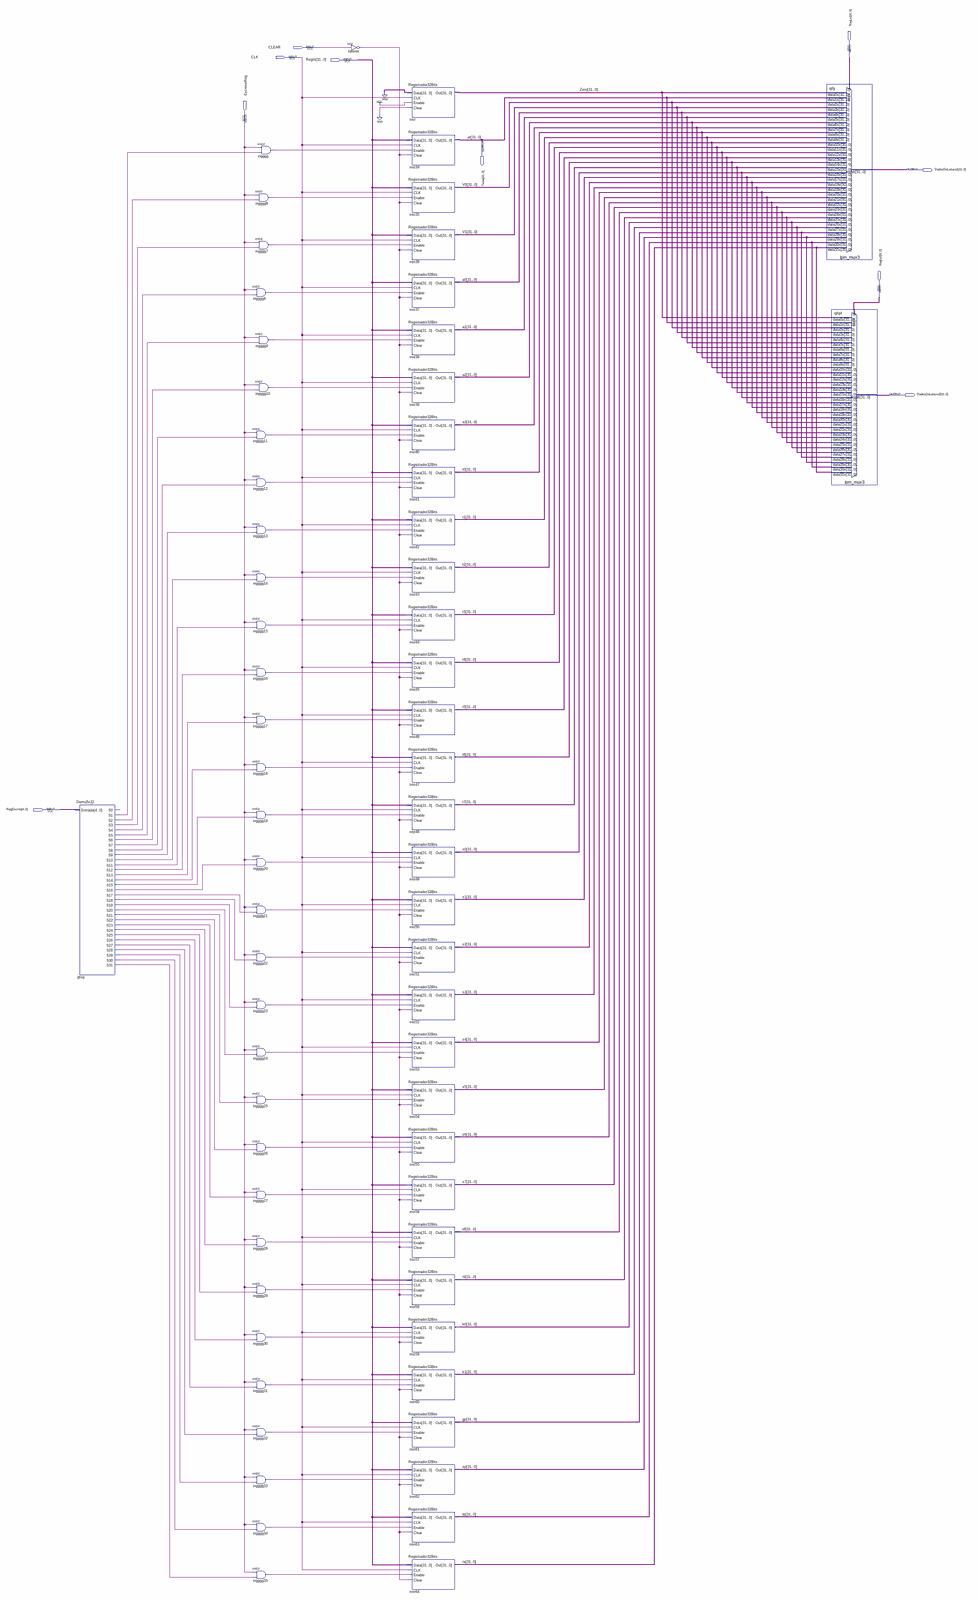
[diagram p0: schematic sheet, whole]
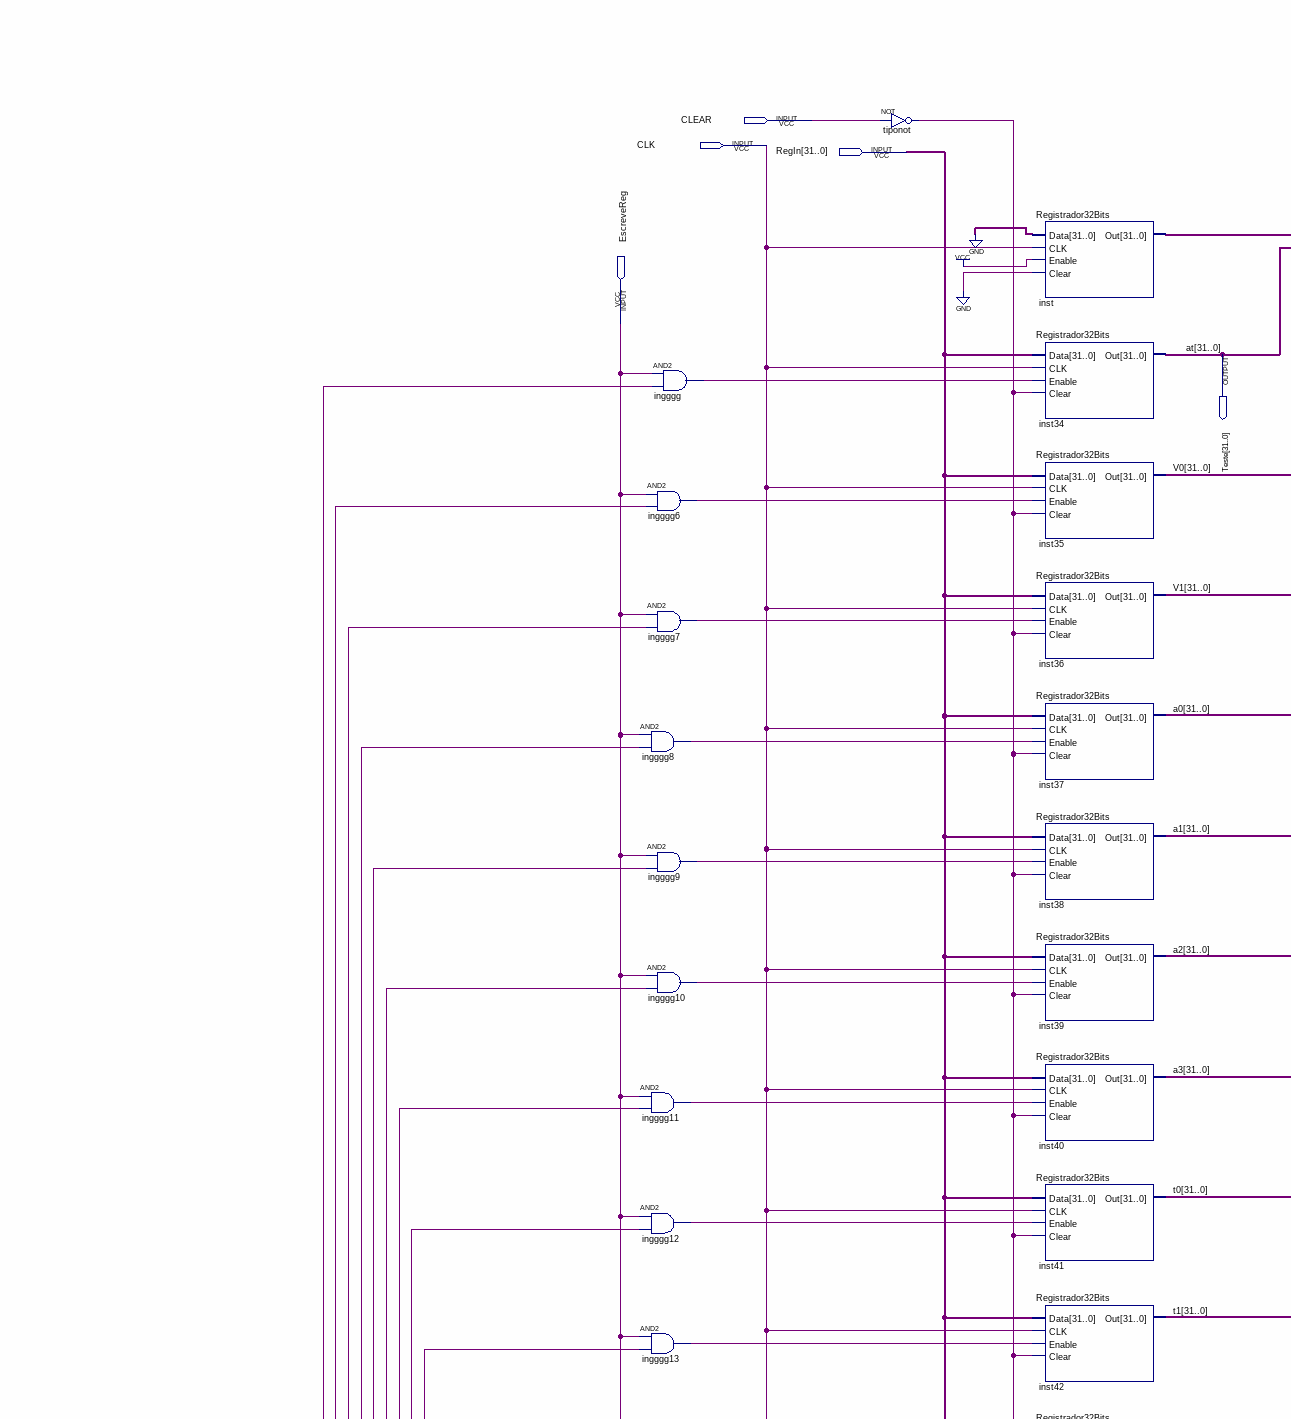
[diagram p1: schematic sheet, upper left part]
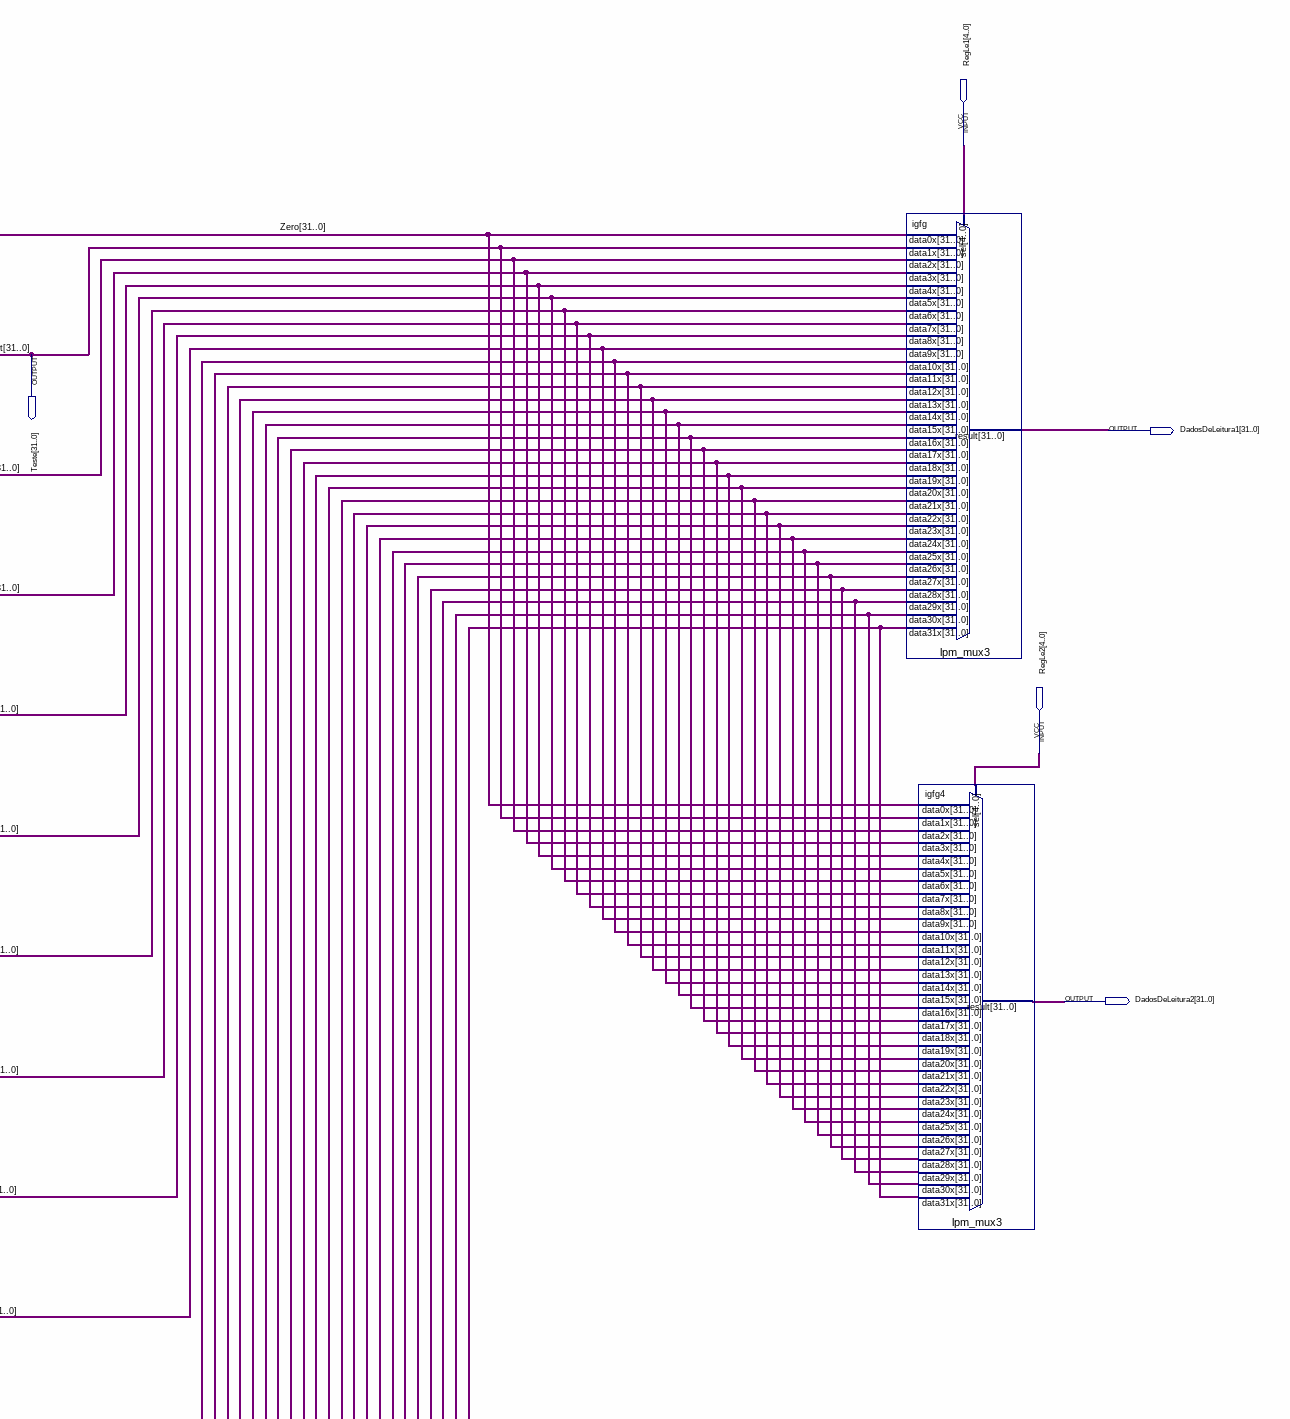
[diagram p2: schematic sheet, upper right part]
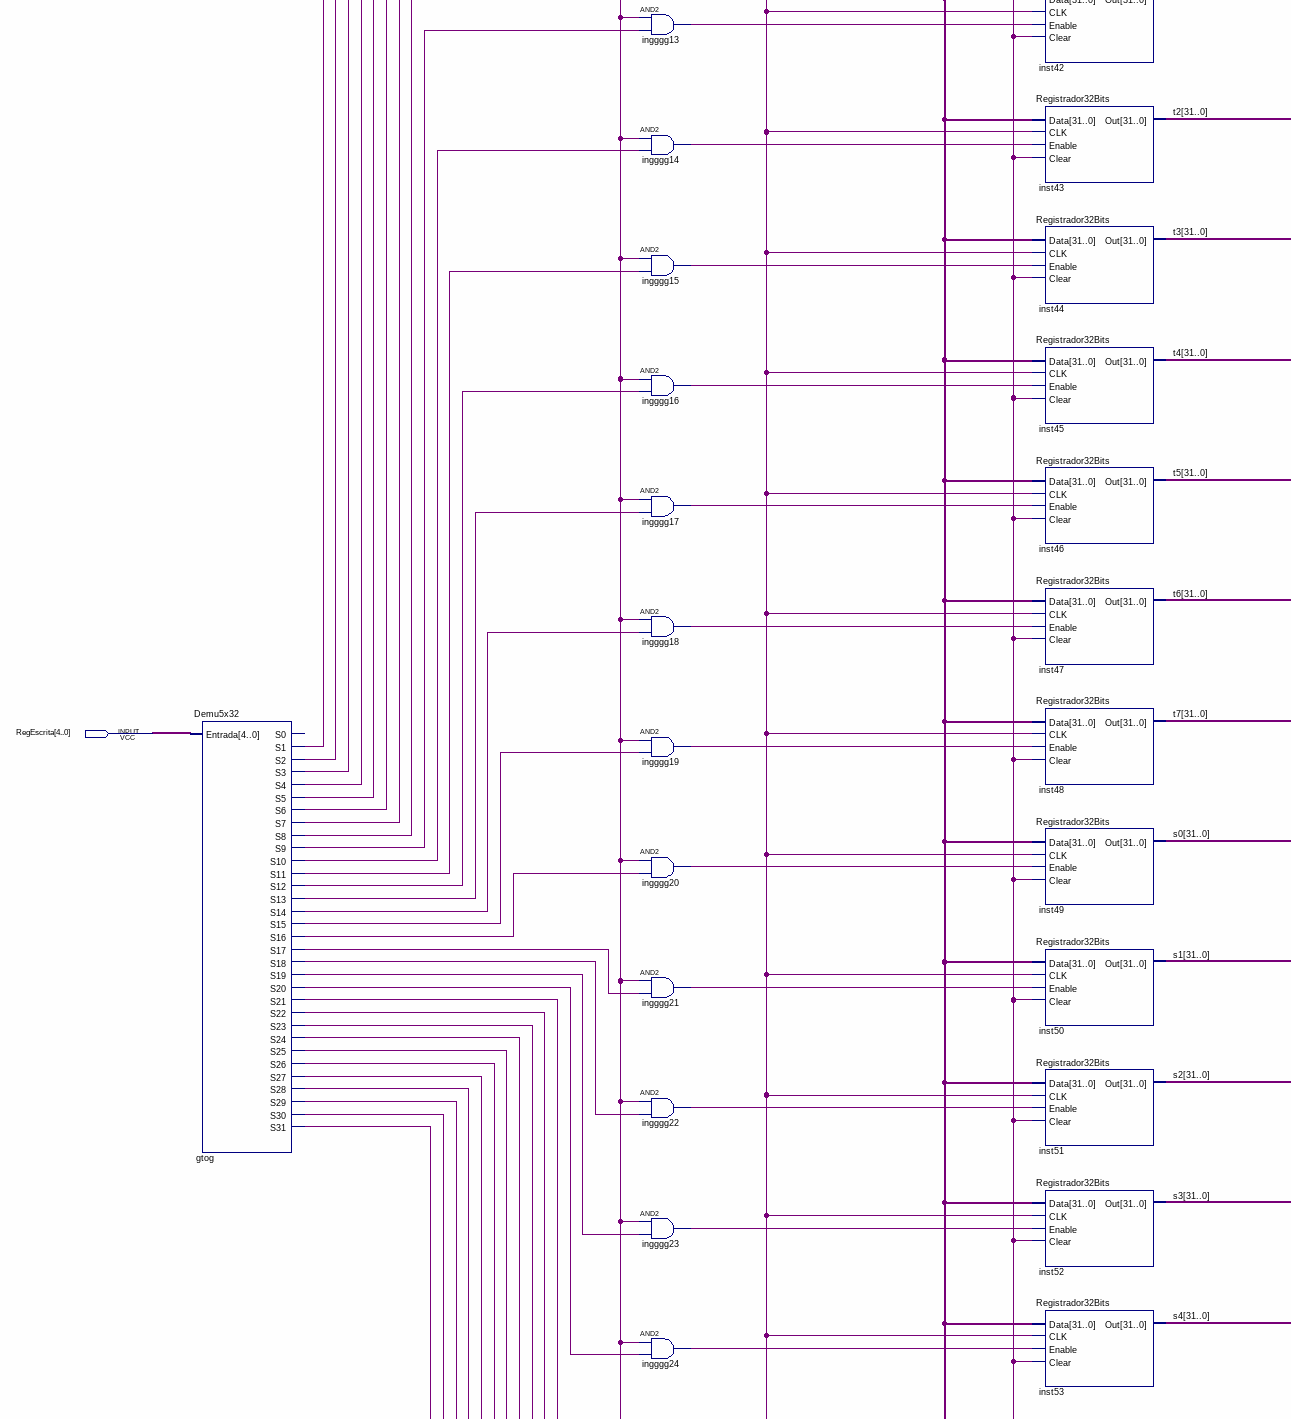
[diagram p3: schematic sheet, middle left part]
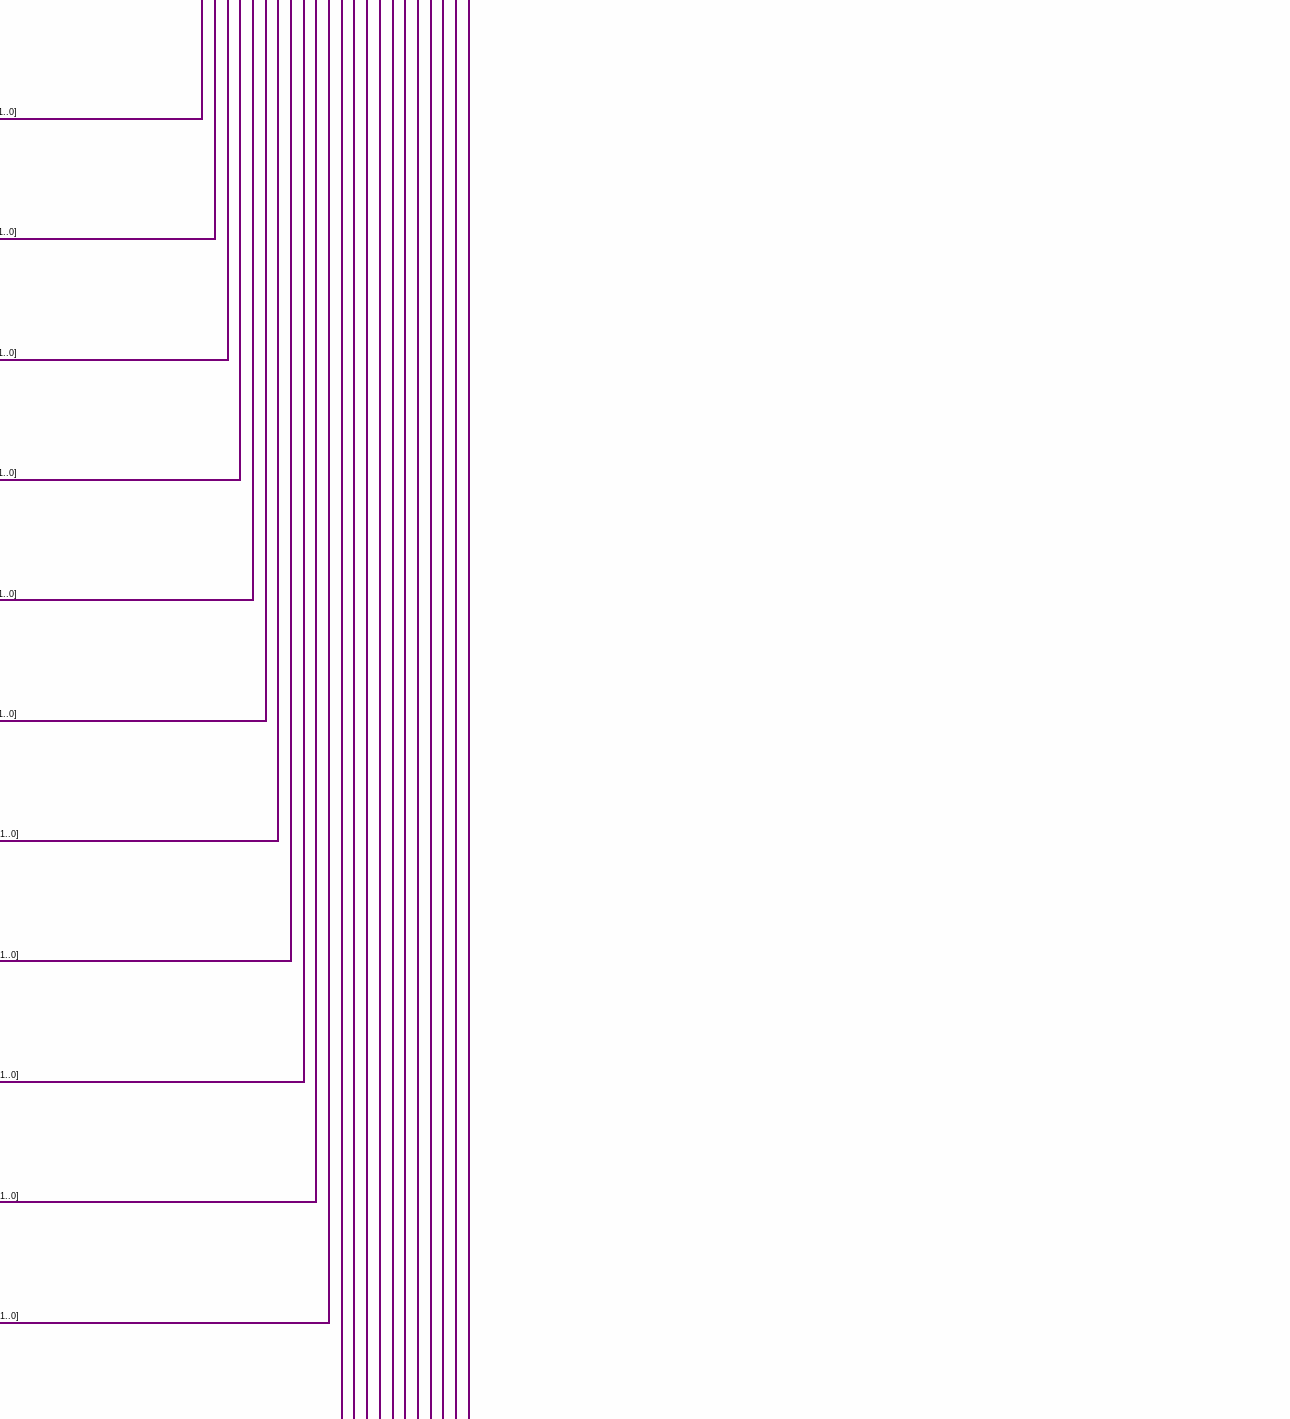
[diagram p4: schematic sheet, middle right part]
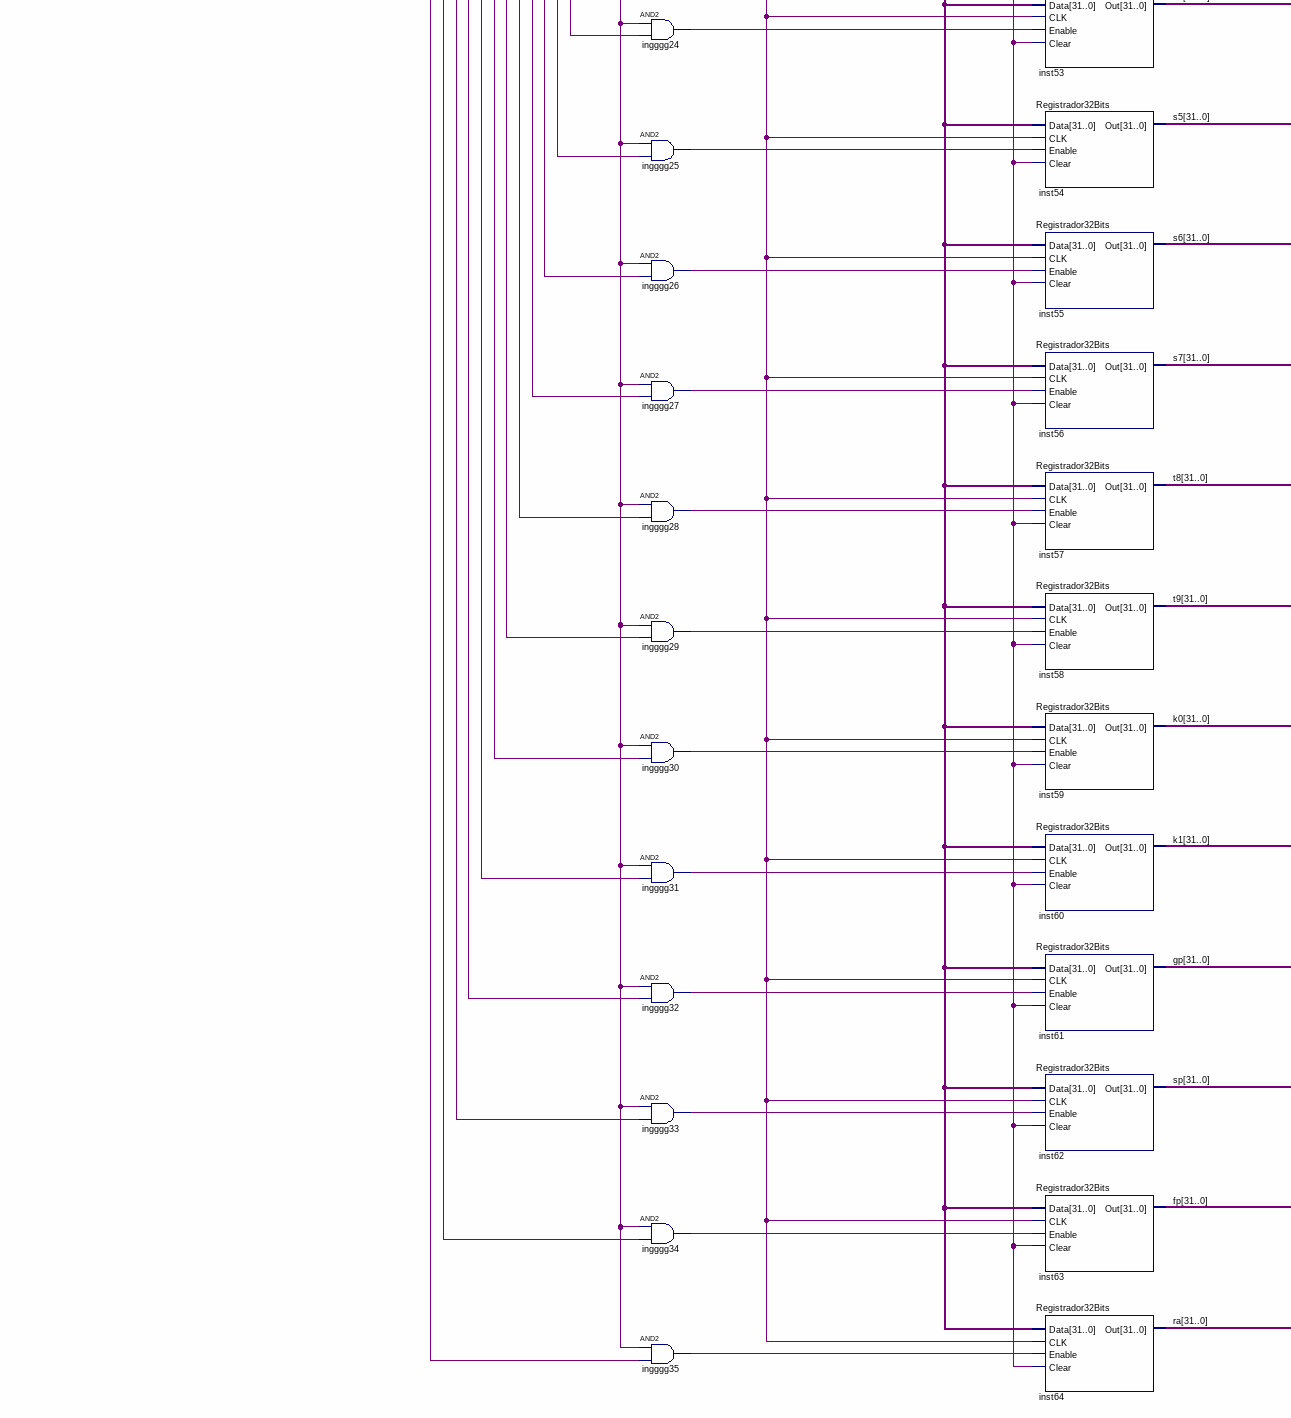
[diagram p5: schematic sheet, lower left part]
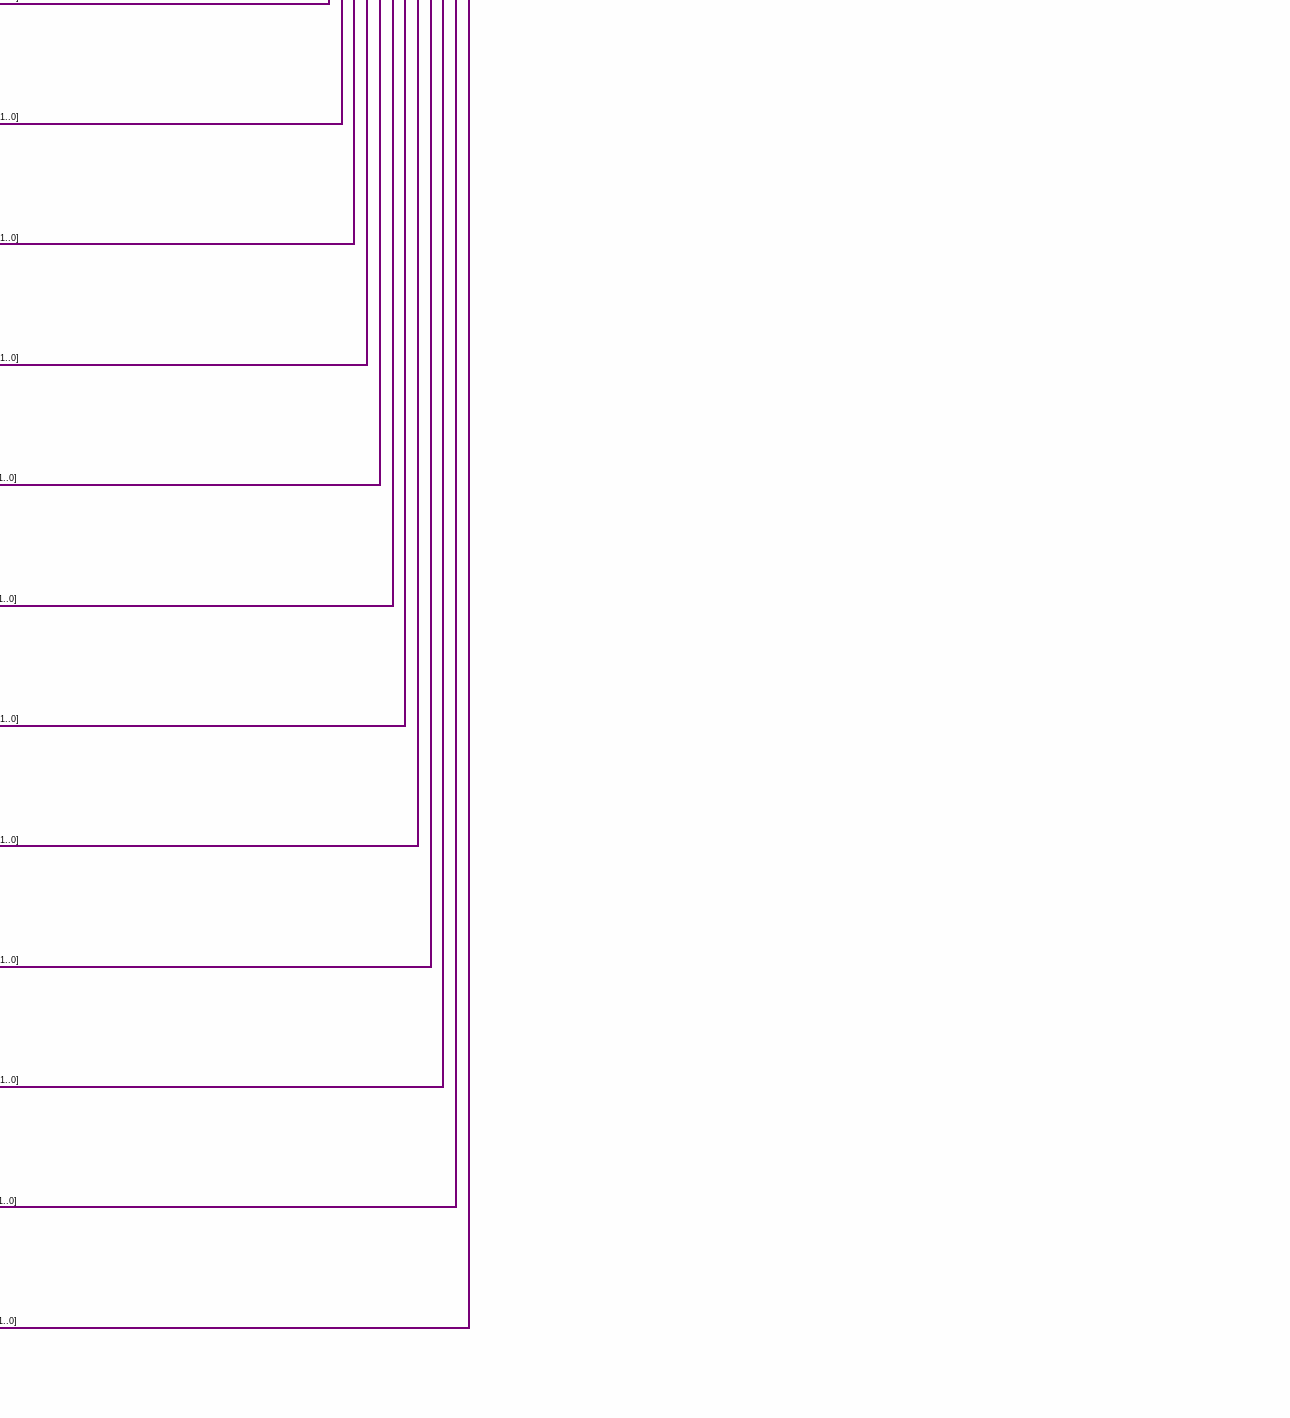
[diagram p6: schematic sheet, lower right part]
// Quartus schematic Bloco_Registradores.bdf as structural Verilog: 67 symbols, 10 pins
module Bloco_Registradores (
  input  CLEAR,
  input  CLK,
  input  [4:0] RegLe1,
  input  [31:0] RegIn,
  input  EscreveReg,
  input  [4:0] RegLe2,
  input  [4:0] RegEscrita,
  output [31:0] Teste,
  output [31:0] DadosDeLeitura1,
  output [31:0] DadosDeLeitura2
);

  wire gtog_s1, gtog_s2, gtog_s3, gtog_s4, gtog_s5, gtog_s6, gtog_s7, gtog_s8, gtog_s9, gtog_s10, gtog_s11,
       gtog_s12, gtog_s13, gtog_s14, gtog_s15, gtog_s16, gtog_s17, gtog_s18, gtog_s19, gtog_s20, gtog_s21,
       gtog_s22, gtog_s23, gtog_s24, gtog_s25, gtog_s26, gtog_s27, gtog_s28, gtog_s29, gtog_s30, gtog_s31,
       ingggg6_out, ingggg7_out, ingggg8_out, ingggg9_out, ingggg10_out, ingggg11_out, ingggg12_out,
       ingggg13_out, ingggg14_out, ingggg15_out, ingggg16_out, ingggg17_out, ingggg18_out, ingggg19_out,
       ingggg20_out, ingggg21_out, ingggg22_out, ingggg23_out, ingggg24_out, ingggg25_out, ingggg26_out,
       ingggg27_out, ingggg28_out, ingggg29_out, ingggg30_out, ingggg31_out, ingggg32_out, ingggg33_out,
       ingggg34_out, ingggg35_out, ingggg_out, tiponot_out;
  wire [31:0] a0, a1, a2, a3, fp, gp, k0, k1, ra, s0, s1, s2, s3, s4, s5, s6, s7, sp, t0, t1, t2, t3, t4, t5,
       t6, t7, t8, t9, V0, V1, Zero;

  Demu5x32 gtog (
    .Entrada(RegEscrita), .S1(gtog_s1), .S2(gtog_s2), .S3(gtog_s3), .S4(gtog_s4), .S5(gtog_s5), .S6(gtog_s6),
    .S7(gtog_s7), .S8(gtog_s8), .S9(gtog_s9), .S10(gtog_s10), .S11(gtog_s11), .S12(gtog_s12), .S13(gtog_s13),
    .S14(gtog_s14), .S15(gtog_s15), .S16(gtog_s16), .S17(gtog_s17), .S18(gtog_s18), .S19(gtog_s19),
    .S20(gtog_s20), .S21(gtog_s21), .S22(gtog_s22), .S23(gtog_s23), .S24(gtog_s24), .S25(gtog_s25),
    .S26(gtog_s26), .S27(gtog_s27), .S28(gtog_s28), .S29(gtog_s29), .S30(gtog_s30), .S31(gtog_s31));  // open: S0
  and ingggg (ingggg_out, EscreveReg, gtog_s1);
  and ingggg6 (ingggg6_out, EscreveReg, gtog_s2);
  and ingggg7 (ingggg7_out, EscreveReg, gtog_s3);
  and ingggg8 (ingggg8_out, EscreveReg, gtog_s4);
  and ingggg9 (ingggg9_out, EscreveReg, gtog_s5);
  and ingggg10 (ingggg10_out, EscreveReg, gtog_s6);
  and ingggg11 (ingggg11_out, EscreveReg, gtog_s7);
  and ingggg12 (ingggg12_out, EscreveReg, gtog_s8);
  and ingggg13 (ingggg13_out, EscreveReg, gtog_s9);
  and ingggg14 (ingggg14_out, EscreveReg, gtog_s10);
  and ingggg15 (ingggg15_out, EscreveReg, gtog_s11);
  and ingggg16 (ingggg16_out, EscreveReg, gtog_s12);
  and ingggg17 (ingggg17_out, EscreveReg, gtog_s13);
  and ingggg18 (ingggg18_out, EscreveReg, gtog_s14);
  and ingggg19 (ingggg19_out, EscreveReg, gtog_s15);
  and ingggg20 (ingggg20_out, EscreveReg, gtog_s16);
  and ingggg21 (ingggg21_out, EscreveReg, gtog_s17);
  and ingggg22 (ingggg22_out, EscreveReg, gtog_s18);
  and ingggg23 (ingggg23_out, EscreveReg, gtog_s19);
  and ingggg24 (ingggg24_out, EscreveReg, gtog_s20);
  and ingggg25 (ingggg25_out, EscreveReg, gtog_s21);
  and ingggg26 (ingggg26_out, EscreveReg, gtog_s22);
  and ingggg27 (ingggg27_out, EscreveReg, gtog_s23);
  and ingggg28 (ingggg28_out, EscreveReg, gtog_s24);
  and ingggg29 (ingggg29_out, EscreveReg, gtog_s25);
  and ingggg30 (ingggg30_out, EscreveReg, gtog_s26);
  and ingggg31 (ingggg31_out, EscreveReg, gtog_s27);
  and ingggg32 (ingggg32_out, EscreveReg, gtog_s28);
  and ingggg33 (ingggg33_out, EscreveReg, gtog_s29);
  and ingggg34 (ingggg34_out, EscreveReg, gtog_s30);
  and ingggg35 (ingggg35_out, EscreveReg, gtog_s31);
  not tiponot (tiponot_out, CLEAR);
  Registrador32Bits inst (.Data({32{1'b0}}), .CLK(CLK), .Enable(1'b1), .Clear(1'b0), .Out(Zero));
  Registrador32Bits inst34 (.Data(RegIn), .CLK(CLK), .Enable(ingggg_out), .Clear(tiponot_out), .Out(Teste));
  Registrador32Bits inst35 (.Data(RegIn), .CLK(CLK), .Enable(ingggg6_out), .Clear(tiponot_out), .Out(V0));
  Registrador32Bits inst36 (.Data(RegIn), .CLK(CLK), .Enable(ingggg7_out), .Clear(tiponot_out), .Out(V1));
  Registrador32Bits inst37 (.Data(RegIn), .CLK(CLK), .Enable(ingggg8_out), .Clear(tiponot_out), .Out(a0));
  Registrador32Bits inst38 (.Data(RegIn), .CLK(CLK), .Enable(ingggg9_out), .Clear(tiponot_out), .Out(a1));
  Registrador32Bits inst39 (.Data(RegIn), .CLK(CLK), .Enable(ingggg10_out), .Clear(tiponot_out), .Out(a2));
  Registrador32Bits inst40 (.Data(RegIn), .CLK(CLK), .Enable(ingggg11_out), .Clear(tiponot_out), .Out(a3));
  Registrador32Bits inst41 (.Data(RegIn), .CLK(CLK), .Enable(ingggg12_out), .Clear(tiponot_out), .Out(t0));
  Registrador32Bits inst42 (.Data(RegIn), .CLK(CLK), .Enable(ingggg13_out), .Clear(tiponot_out), .Out(t1));
  Registrador32Bits inst43 (.Data(RegIn), .CLK(CLK), .Enable(ingggg14_out), .Clear(tiponot_out), .Out(t2));
  Registrador32Bits inst44 (.Data(RegIn), .CLK(CLK), .Enable(ingggg15_out), .Clear(tiponot_out), .Out(t3));
  Registrador32Bits inst45 (.Data(RegIn), .CLK(CLK), .Enable(ingggg16_out), .Clear(tiponot_out), .Out(t4));
  Registrador32Bits inst46 (.Data(RegIn), .CLK(CLK), .Enable(ingggg17_out), .Clear(tiponot_out), .Out(t5));
  Registrador32Bits inst47 (.Data(RegIn), .CLK(CLK), .Enable(ingggg18_out), .Clear(tiponot_out), .Out(t6));
  Registrador32Bits inst48 (.Data(RegIn), .CLK(CLK), .Enable(ingggg19_out), .Clear(tiponot_out), .Out(t7));
  Registrador32Bits inst49 (.Data(RegIn), .CLK(CLK), .Enable(ingggg20_out), .Clear(tiponot_out), .Out(s0));
  Registrador32Bits inst50 (.Data(RegIn), .CLK(CLK), .Enable(ingggg21_out), .Clear(tiponot_out), .Out(s1));
  Registrador32Bits inst51 (.Data(RegIn), .CLK(CLK), .Enable(ingggg22_out), .Clear(tiponot_out), .Out(s2));
  Registrador32Bits inst52 (.Data(RegIn), .CLK(CLK), .Enable(ingggg23_out), .Clear(tiponot_out), .Out(s3));
  Registrador32Bits inst53 (.Data(RegIn), .CLK(CLK), .Enable(ingggg24_out), .Clear(tiponot_out), .Out(s4));
  Registrador32Bits inst54 (.Data(RegIn), .CLK(CLK), .Enable(ingggg25_out), .Clear(tiponot_out), .Out(s5));
  Registrador32Bits inst55 (.Data(RegIn), .CLK(CLK), .Enable(ingggg26_out), .Clear(tiponot_out), .Out(s6));
  Registrador32Bits inst56 (.Data(RegIn), .CLK(CLK), .Enable(ingggg27_out), .Clear(tiponot_out), .Out(s7));
  Registrador32Bits inst57 (.Data(RegIn), .CLK(CLK), .Enable(ingggg28_out), .Clear(tiponot_out), .Out(t8));
  Registrador32Bits inst58 (.Data(RegIn), .CLK(CLK), .Enable(ingggg29_out), .Clear(tiponot_out), .Out(t9));
  Registrador32Bits inst59 (.Data(RegIn), .CLK(CLK), .Enable(ingggg30_out), .Clear(tiponot_out), .Out(k0));
  Registrador32Bits inst60 (.Data(RegIn), .CLK(CLK), .Enable(ingggg31_out), .Clear(tiponot_out), .Out(k1));
  Registrador32Bits inst61 (.Data(RegIn), .CLK(CLK), .Enable(ingggg32_out), .Clear(tiponot_out), .Out(gp));
  Registrador32Bits inst62 (.Data(RegIn), .CLK(CLK), .Enable(ingggg33_out), .Clear(tiponot_out), .Out(sp));
  Registrador32Bits inst63 (.Data(RegIn), .CLK(CLK), .Enable(ingggg34_out), .Clear(tiponot_out), .Out(fp));
  Registrador32Bits inst64 (.Data(RegIn), .CLK(CLK), .Enable(ingggg35_out), .Clear(tiponot_out), .Out(ra));
  lpm_mux3 igfg (
    .data31x(ra), .data30x(fp), .data29x(sp), .data28x(gp), .data27x(k1), .data26x(k0), .data25x(t9),
    .data24x(t8), .data23x(s7), .data22x(s6), .data21x(s5), .data20x(s4), .data19x(s3), .data18x(s2),
    .data17x(s1), .data16x(s0), .data15x(t7), .data14x(t6), .data13x(t5), .data12x(t4), .data11x(t3),
    .data10x(t2), .data9x(t1), .data8x(t0), .data7x(a3), .data6x(a2), .data5x(a1), .data4x(a0), .data3x(V1),
    .data2x(V0), .data1x(Teste), .data0x(Zero), .sel(RegLe1), .result(DadosDeLeitura1));
  lpm_mux3 igfg4 (
    .data31x(ra), .data30x(fp), .data29x(sp), .data28x(gp), .data27x(k1), .data26x(k0), .data25x(t9),
    .data24x(t8), .data23x(s7), .data22x(s6), .data21x(s5), .data20x(s4), .data19x(s3), .data18x(s2),
    .data17x(s1), .data16x(s0), .data15x(t7), .data14x(t6), .data13x(t5), .data12x(t4), .data11x(t3),
    .data10x(t2), .data9x(t1), .data8x(t0), .data7x(a3), .data6x(a2), .data5x(a1), .data4x(a0), .data3x(V1),
    .data2x(V0), .data1x(Teste), .data0x(Zero), .sel(RegLe2), .result(DadosDeLeitura2));

  // Other names for the same wires on the sheet: at[31:0] = Teste
endmodule
